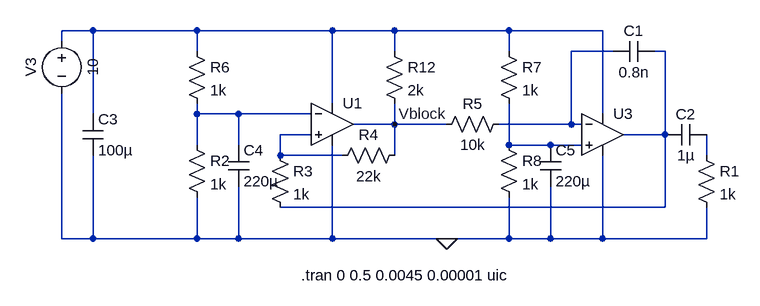
[diagram p0: schematic Triangular_signal_generator.asc]
Triangular_signal_generator.asc, the LTspice schematic file:
Version 4
SHEET 1 1568 708
WIRE -736 288 -784 288
WIRE -576 288 -736 288
WIRE -368 288 -576 288
WIRE -272 288 -368 288
WIRE -96 288 -272 288
WIRE 48 288 -96 288
WIRE -784 304 -784 288
WIRE -576 320 -576 288
WIRE -272 320 -272 288
WIRE -96 320 -96 288
WIRE 64 320 0 320
WIRE 144 320 128 320
WIRE -368 400 -368 288
WIRE -736 416 -736 288
WIRE -576 416 -576 400
WIRE -512 416 -576 416
WIRE -400 416 -512 416
WIRE 48 416 48 288
WIRE -272 432 -272 400
WIRE -272 432 -336 432
WIRE -192 432 -272 432
WIRE 0 432 0 320
WIRE 0 432 -112 432
WIRE 16 432 0 432
WIRE -400 448 -448 448
WIRE 144 448 144 320
WIRE 144 448 80 448
WIRE -576 464 -576 416
WIRE -512 464 -512 416
WIRE -96 464 -96 400
WIRE -32 464 -96 464
WIRE 16 464 -32 464
WIRE -448 480 -448 448
WIRE -352 480 -448 480
WIRE -272 480 -272 432
WIRE 208 480 208 448
WIRE 144 560 144 448
WIRE 144 560 -448 560
WIRE -784 608 -784 384
WIRE -736 608 -736 480
WIRE -736 608 -784 608
WIRE -576 608 -576 544
WIRE -576 608 -736 608
WIRE -512 608 -512 528
WIRE -512 608 -576 608
WIRE -368 608 -368 464
WIRE -368 608 -512 608
WIRE -192 608 -368 608
WIRE -96 608 -96 544
WIRE -96 608 -192 608
WIRE -32 608 -32 528
WIRE -32 608 -96 608
WIRE 48 608 48 480
WIRE 48 608 -32 608
WIRE 208 608 208 560
WIRE 208 608 48 608
FLAG -192 608 0
FLAG -272 432 Vblock
SYMBOL res -464 464 R0
SYMATTR InstName R3
SYMATTR Value 1k
SYMBOL res -256 464 R90
WINDOW 0 0 56 VBottom 2
WINDOW 3 32 56 VTop 2
SYMATTR InstName R4
SYMATTR Value 22k
SYMBOL res -96 416 R90
WINDOW 0 0 56 VBottom 2
WINDOW 3 32 56 VTop 2
SYMATTR InstName R5
SYMATTR Value 10k
SYMBOL cap 128 304 R90
WINDOW 0 0 32 VBottom 2
WINDOW 3 32 32 VTop 2
SYMATTR InstName C1
SYMATTR Value 0.8n
SYMBOL voltage -784 288 R0
WINDOW 0 -32 56 VBottom 2
WINDOW 3 32 56 VTop 2
WINDOW 123 0 0 Left 2
WINDOW 39 0 0 Left 2
SYMATTR InstName V3
SYMATTR Value 10
SYMBOL res -288 304 R0
SYMATTR InstName R12
SYMATTR Value 2k
SYMBOL Opamps\\UniversalOpamp2 -368 432 R0
SYMATTR InstName U1
SYMBOL Opamps\\UniversalOpamp2 48 448 R0
SYMATTR InstName U3
SYMBOL cap 208 432 R90
WINDOW 0 0 32 VBottom 2
WINDOW 3 32 32 VTop 2
SYMATTR InstName C2
SYMATTR Value 1µ
SYMBOL res 192 464 R0
SYMATTR InstName R1
SYMATTR Value 1k
SYMBOL cap -752 416 R0
SYMATTR InstName C3
SYMATTR Value 100µ
SYMBOL res -592 448 R0
SYMATTR InstName R2
SYMATTR Value 1k
SYMBOL res -592 304 R0
SYMATTR InstName R6
SYMATTR Value 1k
SYMBOL res -112 304 R0
SYMATTR InstName R7
SYMATTR Value 1k
SYMBOL res -112 448 R0
SYMATTR InstName R8
SYMATTR Value 1k
SYMBOL cap -528 464 R0
SYMATTR InstName C4
SYMATTR Value 220µ
SYMBOL cap -48 464 R0
SYMATTR InstName C5
SYMATTR Value 220µ
TEXT -416 664 Left 2 !.tran 0 0.5 0.0045 0.00001 uic

The netlist it stands for:
* Triangular_signal_generator.asc
R3 N005 N003 1k
R4 Vblock N005 22k
R5 N002 Vblock 10k
C1 N003 N002 0.8n
V3 N001 0 10
R12 N001 Vblock 2k
XU1 N005 N004 N001 0 Vblock level.2 Avol=1Meg GBW=10Meg Slew=10Meg ilimit=25m rail=0 Vos=0 phimargin=45 en=0 enk=0 in=0 ink=0 Rin=500Meg  ; pins IN+ IN- V+ V- OUT
XU3 N006 N002 N001 0 N003 level.2 Avol=1Meg GBW=10Meg Slew=10Meg ilimit=25m rail=0 Vos=0 phimargin=45 en=0 enk=0 in=0 ink=0 Rin=500Meg  ; pins IN+ IN- V+ V- OUT
C2 N007 N003 1µ
R1 N007 0 1k
C3 N001 0 100µ
R2 N004 0 1k
R6 N001 N004 1k
R7 N001 N006 1k
R8 N006 0 1k
C4 N004 0 220µ
C5 N006 0 220µ
.tran 0 0.5 0.0045 0.00001 uic
.lib UniversalOpamps2.sub
.backanno
.end